# Altium schematic sheet origin.SchDoc
size 400 x 279 mm; SheetNumber: 1; SheetTotal: 4; SPICEModelCacheTWHSCXQX: <root> / <DocumentId>TWHSCXQX</DocumentId> / </root>
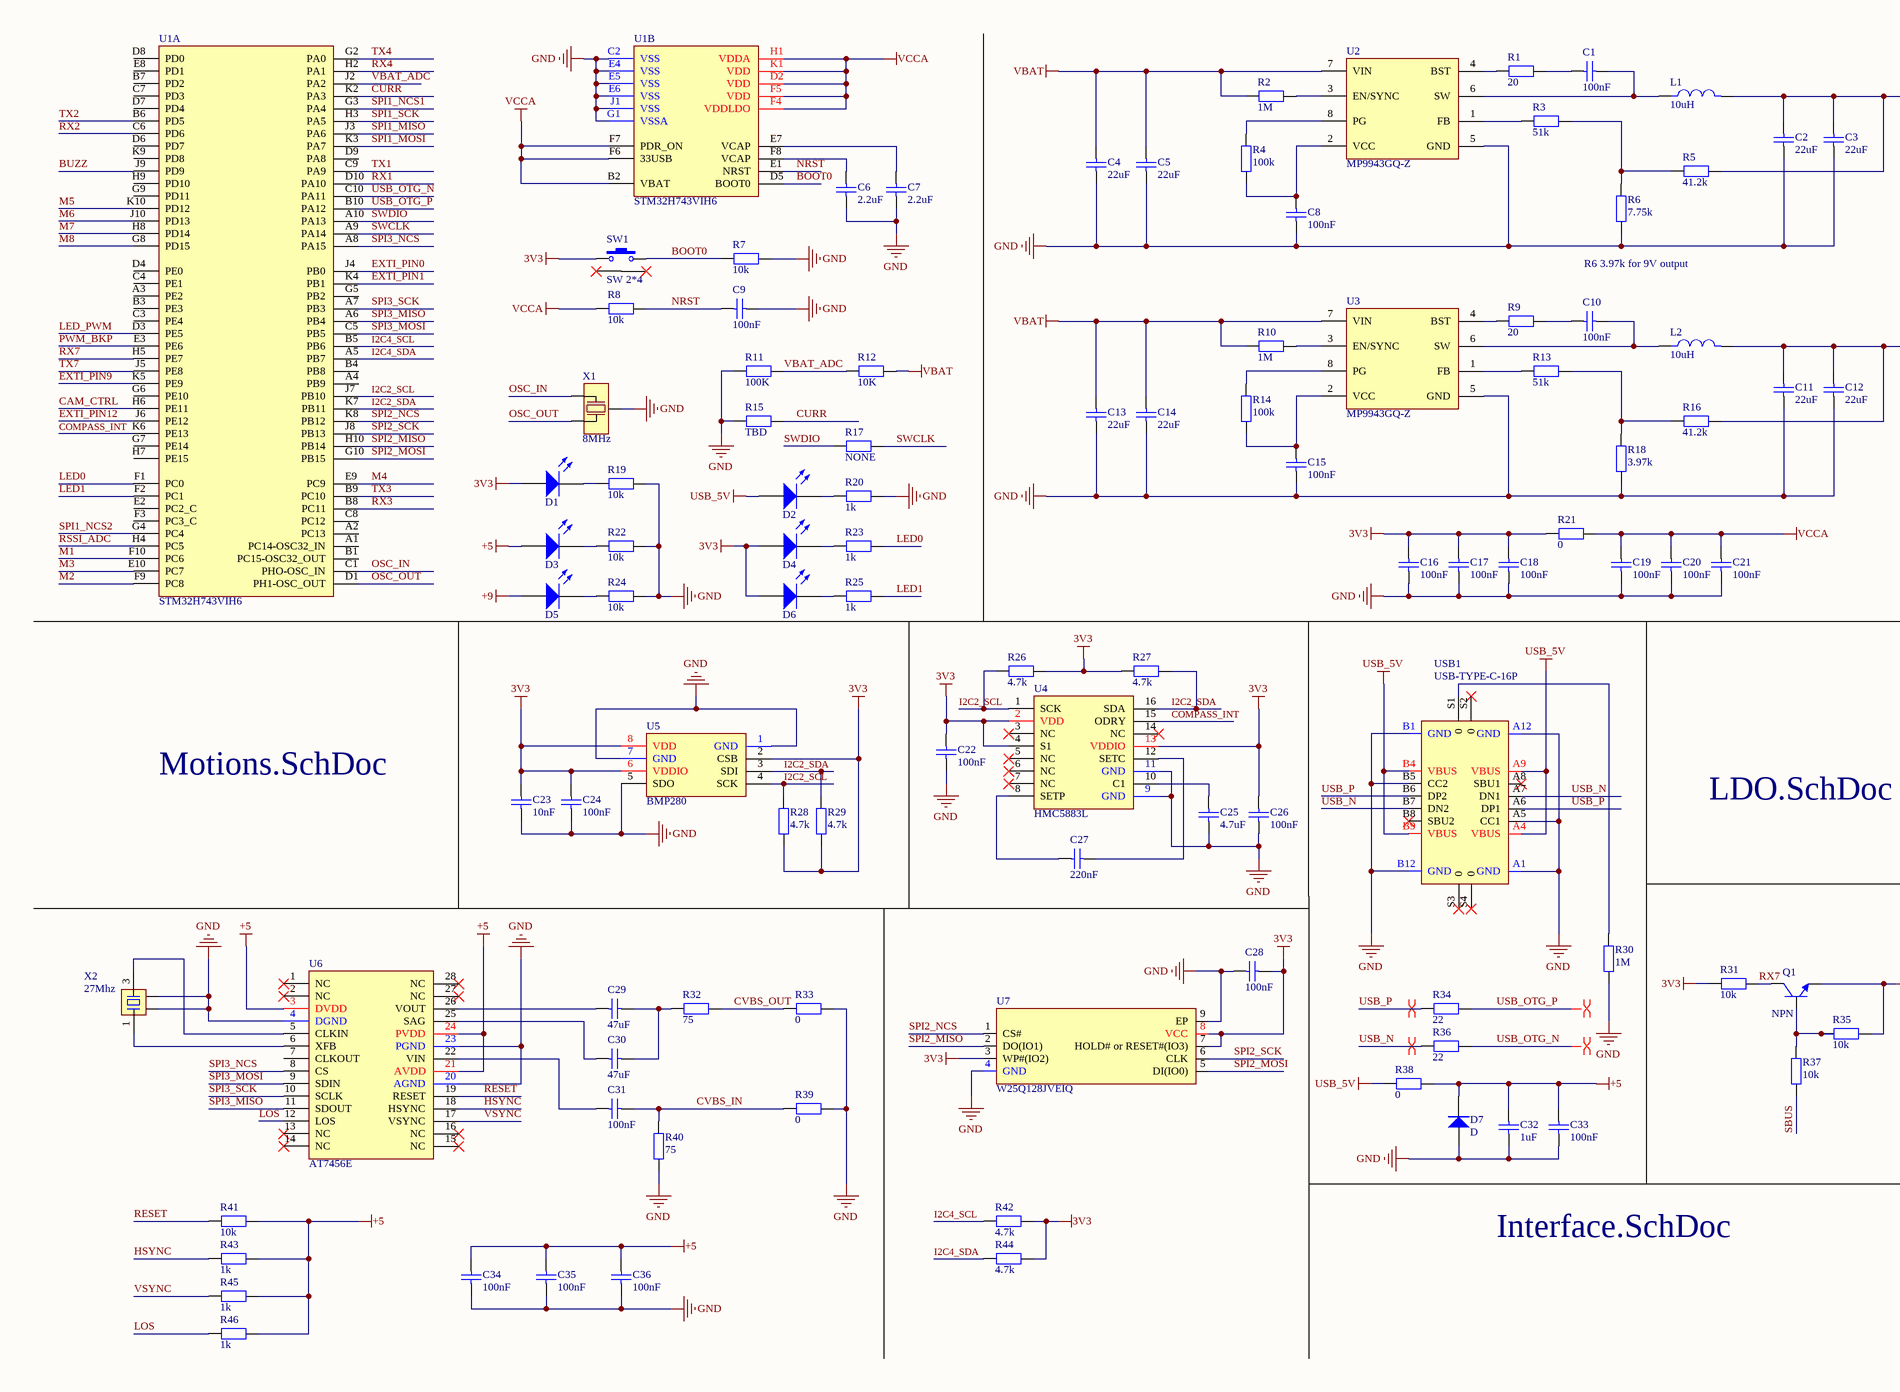
[diagram p0: origin.SchDoc, left]
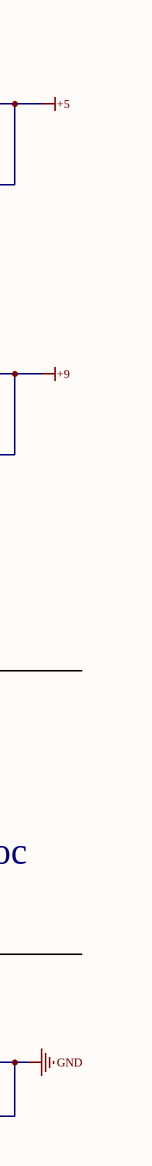
[diagram p1: origin.SchDoc, middle]

## Parts
C1  100nF  [C0402_NS]
C2  22uF  [C1206_NS]
C3  22uF  [C1206_NS]
C4  22uF  [C1206_NS]
C5  22uF  [C1206_NS]
C6  2.2uF  [C0402_NS]
C7  2.2uF  [C0402_NS]
C8  100nF  [C0402_NS]
C9  100nF  [C0402_NS]
C10  100nF  [C0402_NS]
C11  22uF  [C1206_NS]
C12  22uF  [C1206_NS]
C13  22uF  [C1206_NS]
C14  22uF  [C1206_NS]
C15  100nF  [C0402_NS]
C16  100nF  [C0402_NS]
C17  100nF  [C0402_NS]
C18  100nF  [C0402_NS]
C19  100nF  [C0402_NS]
C20  100nF  [C0402_NS]
C21  100nF  [C0402_NS]
C22  100nF  [C0402_NS]
C23  10nF  [C0402_NS]
C24  100nF  [C0402_NS]
C25  4.7uF  [C0402_NS]
C26  100nF  [C0402_NS]
C27  220nF  [C0402_NS]
C28  100nF  [C0402_NS]
C29  47uF  [C_3528]
C30  47uF  [C_3528]
C31  100nF  [C0805_NS]
C32  1uF  [C0402_NS]
C33  100nF  [C0402_NS]
C34  100nF  [C0402_NS]
C35  100nF  [C0402_NS]
C36  100nF  [C0402_NS]
D1  LED  [LED0402-B]  (value not drawn)
D2  LED  [LED0402-B]  (value not drawn)
D3  LED  [LED0402-B]  (value not drawn)
D4  LED  [LED0402-B]  (value not drawn)
D5  LED  [LED0402-B]  (value not drawn)
D6  LED  [LED0402-B]  (value not drawn)
D7  D  [SOD-123]
L1  10uH  [IHLP2020]
L2  10uH  [IHLP2020]
Q1  NPN  [SOT23-3]
R1  20  [R0402_NS]
R2  1M  [R0402_NS]
R3  51k  [R0402_NS]
R4  100k  [R0402_NS]
R5  41.2k  [R0402_NS]
R6  7.75k  [R0402_NS]
R7  10k  [R0402_NS]
R8  10k  [R0402_NS]
R9  20  [R0402_NS]
R10  1M  [R0402_NS]
R11  100K  [R0402_NS]
R12  10K  [R0402_NS]
R13  51k  [R0402_NS]
R14  100k  [R0402_NS]
R15  TBD  [R0603_NS]
R16  41.2k  [R0402_NS]
R17  NONE  [R0402_NS]
R18  3.97k  [R0402_NS]
R19  10k  [R0402_NS]
R20  1k  [R0402_NS]
R21  0  [R0402_NS]
R22  10k  [R0402_NS]
R23  1k  [R0402_NS]
R24  10k  [R0402_NS]
R25  1k  [R0402_NS]
R26  4.7k  [R0402_NS]
R27  4.7k  [R0402_NS]
R28  4.7k  [R0402_NS]
R29  4.7k  [R0402_NS]
R30  1M  [R0402_NS]
R31  10k  [R0402_NS]
R32  75  [R0402_NS]
R33  0  [R0402_NS]
R34  22  [R0402_NS]
R35  10k  [R0402_NS]
R36  22  [R0402_NS]
R37  10k  [R0402_NS]
R38  0  [R0603_NS]
R39  0  [R0402_NS]
R40  75  [R0402_NS]
R41  10k  [R0402_NS]
R42  4.7k  [R0402_NS]
R43  1k  [R0402_NS]
R44  4.7k  [R0402_NS]
R45  1k  [R0402_NS]
R46  1k  [R0402_NS]
SW1  SW 2*4  [SW2*4]
U1  STM32H743VIH6  [TFBGA100]  (parts A,B of 2)
U2  MP9943GQ-Z  [DFN-8]
U3  MP9943GQ-Z  [DFN-8]
U4  HMC5883L  [LGA-16]
U5  BMP280  [LGA-8-BMP280]
U6  AT7456E  [TSSOP28]
U7  W25Q128JVEIQ  [WSON-8]
USB1  USB-TYPE-C-16P  [USB-C-SMD_16P]
X1  8MHz  [OSC-SMD-3]
X2  27Mhz  [XTAL-2025-4P]

## Nets
3V3: C16.1 C17.1 C18.1 C22.1 C23.1 C24.1 C26.1 C28.2 D1.1(A) D4.1(A) D6.1(A) R21.1 R26.1 R27.2 R28.2 R29.2 R31.2 R42.2 R44.2 SW1.1 U4.2(VDD) U4.4(S1) U4.13(VDDIO) U5.2(CSB) U5.6(VDDIO) U5.8(VDD) U7.3(WP#(IO2)) U7.7(HOLD#_or_RESET#(IO3)) U7.8(VCC)
+5: C2.2 C3.2 C32.1 C33.1 C34.1 C35.1 C36.1 D3.1(A) D7.2(K) L1.2 R5.1 R38.2 R41.2 R43.2 R45.2 R46.2 U6.3(DVDD) U6.21(AVDD) U6.24(PVDD)
+9: C11.2 C12.2 D5.1(A) L2.2 R16.1
GND: C2.1 C3.1 C4.1 C5.1 C6.1 C7.1 C8.1 C9.1 C11.1 C12.1 C13.1 C14.1 C15.1 C16.2 C17.2 C18.2 C19.2 C20.2 C21.2 C22.2 C23.2 C24.2 C25.2 C26.2 C28.1 C32.2 C33.2 C34.2 C35.2 C36.2 D7.1(A) Q1.2(E) R6.2 R7.2 R11.1 R15.1 R18.2 R19.2 R20.2 R22.2 R24.2 R30.2 R33.2 R35.1 R39.1 R40.1 U1.C2(VSS) U1.E4(VSS) U1.E5(VSS) U1.E6(VSS) U1.G1(VSSA) U1.J1(VSS) U2.5(GND) U3.5(GND) U4.9(GND) U4.11(GND) U5.1(GND) U5.5(SDO) U5.7(GND) U6.4(DGND) U6.20(AGND) U6.23(PGND) U7.4(GND) U7.9(EP) USB1.A1(GND) USB1.A5(CC1) USB1.A12(GND) USB1.B1(GND) USB1.B5(CC2) USB1.B12(GND) X1.2(GND) X2.2 X2.4
USB_5V: D2.1(A) R38.1 USB1.A4(VBUS) USB1.A9(VBUS) USB1.B4(VBUS) USB1.B9(VBUS)
VBAT: C4.2 C5.2 C13.2 C14.2 R2.2 R10.2 R12.2 U2.7(VIN) U3.7(VIN)
VCCA: C19.1 C20.1 C21.1 R8.1 R21.2 U1.B2(VBAT) U1.D2(VDD) U1.F4(VDDLDO) U1.F5(VDD) U1.F6(33USB) U1.F7(PDR_ON) U1.H1(VDDA) U1.K1(VDD)
BOOT0: R7.1 SW1.2 U1.D5(BOOT0)
BUZZ: U1.J9(PD9)
CAM_CTRL: U1.H6(PE11)
COMPASS_INT: U1.K6(PE13) U4.15(ODRY)
CURR: R15.2 U1.K2(PA3)
CVBS_IN: C31.2 R39.2 R40.2
CVBS_OUT: R32.2 R33.1
EXTI_PIN0: U1.J4(PB0)
EXTI_PIN1: U1.K4(PB1)
EXTI_PIN9: U1.K5(PE9)
EXTI_PIN12: U1.J6(PE12)
HSYNC: R43.1 U6.18(HSYNC)
I2C2_SCL: R26.2 R28.1 U1.J7(PB10) U4.1(SCK) U5.4(SCK)
I2C2_SDA: R27.1 R29.1 U1.K7(PB11) U4.16(SDA) U5.3(SDI)
I2C4_SCL: R42.1 U1.B5(PB6)
I2C4_SDA: R44.1 U1.A5(PB7)
LED0: R23.2 U1.F1(PC0)
LED1: R25.2 U1.F2(PC1)
LED_PWM: U1.D3(PE5)
LOS: R46.1 U6.12(LOS)
M1: U1.F10(PC6)
M2: U1.F9(PC8)
M3: U1.E10(PC7)
M4: U1.E9(PC9)
M5: U1.K10(PD12)
M6: U1.J10(PD13)
M7: U1.H8(PD14)
M8: U1.G8(PD15)
NRST: C9.2 R8.2 U1.E1(NRST)
OSC_IN: U1.C1(PHO-OSC_IN) X1.1(OSC_IN)
OSC_OUT: U1.D1(PH1-OSC_OUT) X1.3(OSC_OUT)
PWM_BKP: U1.E3(PE6)
RESET: R41.1 U6.19(RESET)
RSSI_ADC: U1.H4(PC5)
RX1: U1.D10(PA10)
RX2: U1.C6(PD6)
RX3: U1.B8(PC11)
RX4: U1.H2(PA1)
RX7: Q1.3(C) R31.1 U1.H5(PE7)
SBUS: R37.2
SPI1_MISO: U1.J3(PA6)
SPI1_MOSI: U1.K3(PA7)
SPI1_NCS1: U1.G3(PA4)
SPI1_NCS2: U1.G4(PC4)
SPI1_SCK: U1.H3(PA5)
SPI2_MISO: U1.H10(PB14) U7.2(DO(IO1))
SPI2_MOSI: U1.G10(PB15) U7.5(DI(IO0))
SPI2_NCS: U1.K8(PB12) U7.1(CS#)
SPI2_SCK: U1.J8(PB13) U7.6(CLK)
SPI3_MISO: U1.A6(PB4) U6.11(SDOUT)
SPI3_MOSI: U1.C5(PB5) U6.9(SDIN)
SPI3_NCS: U1.A8(PA15) U6.8(CS)
SPI3_SCK: U1.A7(PB3) U6.10(SCLK)
SWCLK: R17.1 U1.A9(PA14)
SWDIO: R17.2 U1.A10(PA13)
TX1: U1.C9(PA9)
TX2: U1.B6(PD5)
TX3: U1.B9(PC10)
TX4: U1.G2(PA0)
TX7: U1.J5(PE8)
USB_N: R36.2 USB1.A7(DN1) USB1.B7(DN2)
USB_OTG_N: R36.1 U1.C10(PA11)
USB_OTG_P: R34.1 U1.B10(PA12)
USB_P: R34.2 USB1.A6(DP1) USB1.B6(DP2)
VBAT_ADC: R11.2 R12.1 U1.J2(PA2)
VSYNC: R45.1 U6.17(VSYNC)
NetC1_1: C1.1 L1.1 U2.6(SW)
NetC1_2: C1.2 R1.1
NetC6_2: C6.2 U1.F8(VCAP)
NetC7_2: C7.2 U1.E7(VCAP)
NetC8_2: C8.2 R4.1 U2.2(VCC)
NetC10_1: C10.1 L2.1 U3.6(SW)
NetC10_2: C10.2 R9.1
NetC15_2: C15.2 R14.1 U3.2(VCC)
NetC25_1: C25.1 U4.10(C1)
NetC27_1: C27.1 U4.8(SETP)
NetC27_2: C27.2 U4.12(SETC)
NetC29_1: C29.1 U6.26(VOUT)
NetC29_2: C29.2 C30.2 R32.1
NetC30_1: C30.1 U6.25(SAG)
NetC31_1: C31.1 U6.22(VIN)
NetD1_2: D1.2(K) R19.1
NetD2_2: D2.2(K) R20.1
NetD3_2: D3.2(K) R22.1
NetD4_2: D4.2(K) R23.1
NetD5_2: D5.2(K) R24.1
NetD6_2: D6.2(K) R25.1
NetQ1_1: Q1.1(B) R35.2 R37.1
NetR1_2: R1.2 U2.4(BST)
NetR2_1: R2.1 U2.3(EN/SYNC)
NetR3_1: R3.1 R5.2 R6.1
NetR3_2: R3.2 U2.1(FB)
NetR4_2: R4.2 U2.8(PG)
NetR9_2: R9.2 U3.4(BST)
NetR10_1: R10.1 U3.3(EN/SYNC)
NetR13_1: R13.1 R16.2 R18.1
NetR13_2: R13.2 U3.1(FB)
NetR14_2: R14.2 U3.8(PG)
NetR30_1: R30.1 USB1.S1(0)
NetU6_5: U6.5(CLKIN) X2.3
NetU6_6: U6.6(XFB) X2.1

Not connected (* = marked no-connect by the designer): SW1 3* 4*; U1 A1(PC14-OSC32_IN) A2(PC13) A3(PE2) A4(PB9) B1(PC15-OSC32_OUT) B3(PE3) B4(PB8) B7(PD2) C3(PE4) C4(PE1) C7(PD3) C8(PC12) D4(PE0) D6(PD7) D7(PD4) D8(PD0) D9(PA8) E2(PC2_C) E8(PD1) F3(PC3_C) G5(PB2) G6(PE10) G7(PE14) G9(PD11) H7(PE15) H9(PD10) K9(PD8); U4 3(NC)* 5(NC)* 6(NC)* 7(NC)* 14(NC)*; U6 1(NC)* 2(NC)* 7(CLKOUT) 13(NC)* 14(NC)* 15(NC)* 16(NC)* 27(NC)* 28(NC)*; USB1 A8(SBU1)* B8(SBU2)* S2(0)* S3(0)* S4(0)*

## Layout directives
differential pair: USB_N, USB_OTG_N, USB_OTG_P, USB_P

## Notes on the sheet
- R6 3.97k for 9V output
- Motions.SchDoc
- LDO.SchDoc
- Interface.SchDoc

## Library data of the parts
C1 C6-C10 C15-C28 C32-C36 = C0402: Capacitance 0402
C2-C5 C11-C14 = C1206: Capacitance 1206
C29 C30 = C
C31 = C0805: Capacitance 0805
D1-D6 = LED0402: 发光二极管; 封装库来自淘宝卖家ID：黄晶宝石: 其他店铺购入均为盗版封装库，请立即申请退款，本店现金奖励20~200元
D7 = D: BOM名称: TVS瞬态抑制二极管; 属性: 30V 600W
L1 L2 = L
Q1 = NPN: NPN三极管
R1-R14 R16-R37 R39-R46 = R0402: Resistance 0402
R15 R38 = R0603: Resistance 0603
SW1 = SW 2*4: 2*4 双进轻触开关
U1 = STM32H743VIH6: 480MHz BGA100 MCU
U2 U3 = MP9943GQ-Z: High Efficiency 3A Peak, 36V, Synchronous Step Down Converter With Power Good
U4 = HMC5883L: Compass, Pin-Pin with QMC5883L
U5 = BMP280: BOSCH Barometer
U6 = AT7456E: 中科微电子 Character Overlay Chip
U7 = W25Q128JVEIQ: 16M SPI Flash WSON-8
USB1 = USB-TYPE-C-16P: TYPE-C USB Male Interface DIP
X1 = Crystal 3P 3213: 3213 Crystal
X2 = Crystal 4P: 4脚无源晶振(谐振器）; 联系卖家，免费查找封装: 唯一出售店铺网址https://shop463601444.taobao.com; BOM名称: 4脚无源晶振(谐振器）